# Altium schematic sheet MCU.SchDoc
size A4; SheetNumber: 1; SheetTotal: 4
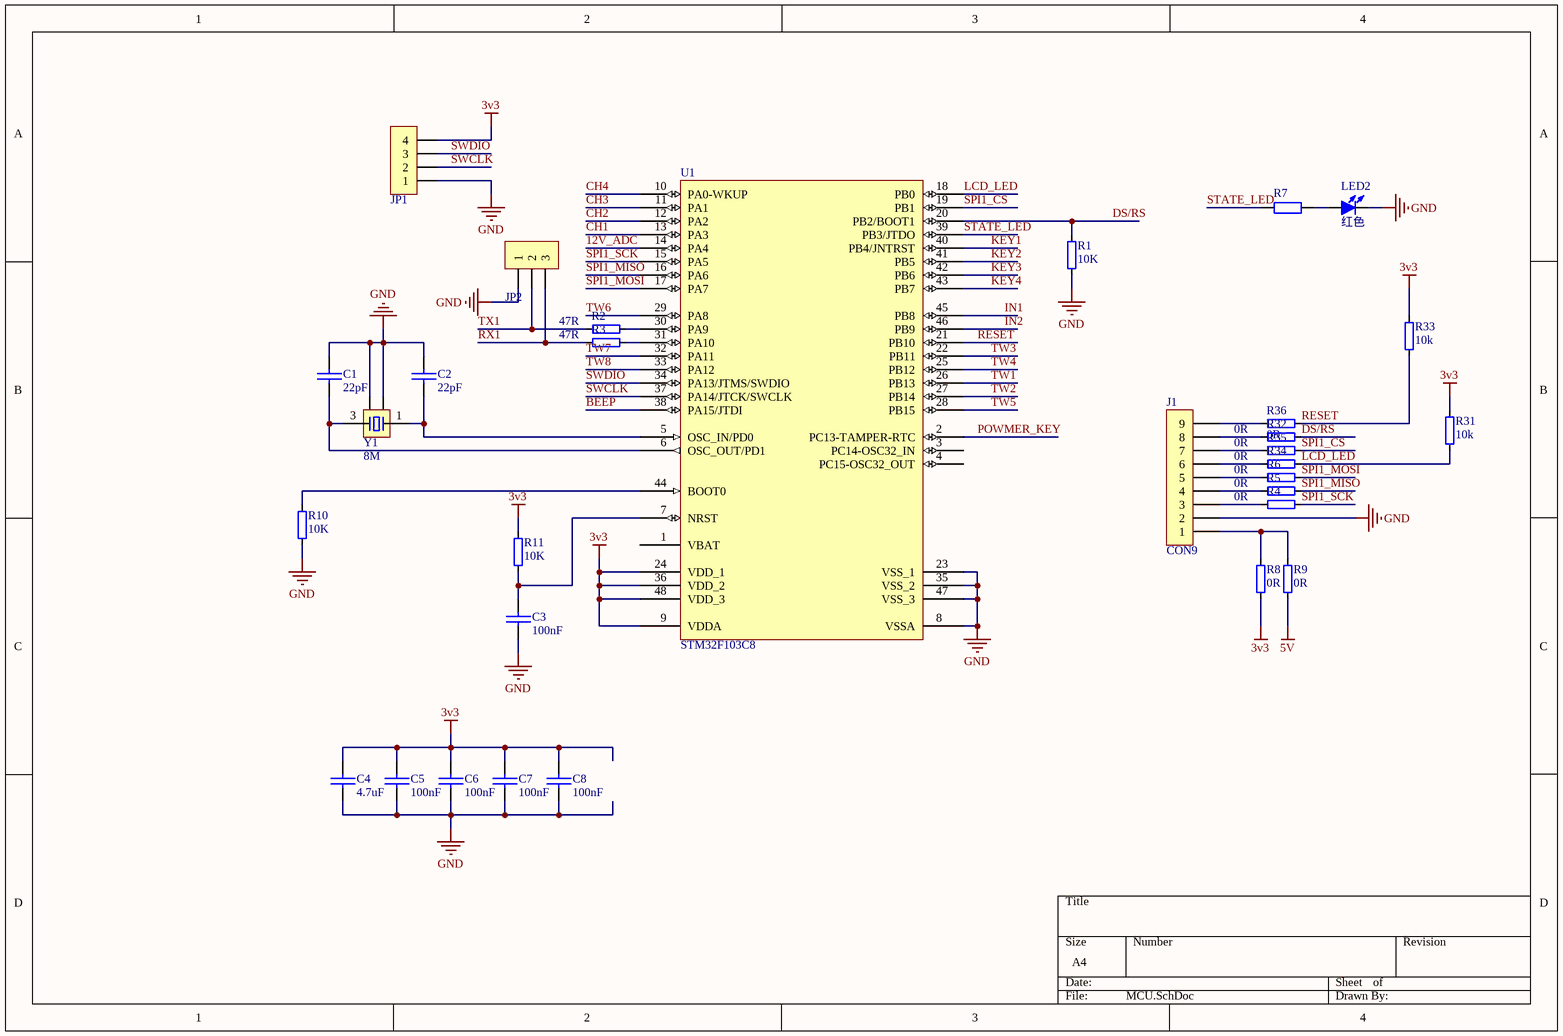
[diagram p0: MCU.SchDoc]

## Parts
C1  22pF  [C 0603_L]
C2  22pF  [C 0603_L]
C3  100nF  [C 0603_L]
C4  4.7uF  [C 0603_L]
C5  100nF  [C 0603_L]
C6  100nF  [C 0603_L]
C7  100nF  [C 0603_L]
C8  100nF  [C 0603_L]
J1  CON9  [HDR2.54-Y-LI-9P]
JP1  HDR-1X4  [HDR2.54-LI-4P]  (value not drawn)
JP2  HDR-1X3  [HDR2.54-LI-3P]  (value not drawn)
LED2  红色  [LED 0805G]
R1  10K  [R 0603_L]
R2  47R  [R 0603_L]
R3  47R  [R 0603_L]
R4  0R  [R 0603_L]
R5  0R  [R 0603_L]
R6  0R  [R 0603_L]
R7  (no value)  [R 0603_L]
R8  0R  [R 0603_L]
R9  0R  [R 0603_L]
R10  10K  [R 0603_L]
R11  10K  [R 0603_L]
R31  10k  [R 0603_L]
R32  0R  [R 0603_L]
R33  10k  [R 0603_L]
R34  0R  [R 0603_L]
R35  0R  [R 0603_L]
R36  0R  [R 0603_L]
U1  STM32F103C8  [LQFP-48_M]
Y1  8M  [OSC 3225-4P]

## Nets
3v3: C4.1 C5.1 C6.1 C7.1 C8.1 JP1.4 R8.2 R11.2 R31.1 R33.1 U1.9(VDDA) U1.24(VDD_1) U1.36(VDD_2) U1.48(VDD_3)
5V: R9.2
GND: C1.1 C2.1 C3.2 C4.2 C5.2 C6.2 C7.2 C8.2 J1.2 JP1.1 JP2.1 LED2.2(K) R1.2 R10.1 U1.8(VSSA) U1.23(VSS_1) U1.35(VSS_2) U1.47(VSS_3) Y1.2 Y1.4
12V_ADC: U1.14(PA4)
BEEP: U1.38(PA15/JTDI)
CH1: U1.13(PA3)
CH2: U1.12(PA2)
CH3: U1.11(PA1)
CH4: U1.10(PA0-WKUP)
DS/RS: R1.1 R32.1 U1.20(PB2/BOOT1)
IN1: U1.45(PB8)
IN2: U1.46(PB9)
KEY1: U1.40(PB4/JNTRST)
KEY2: U1.41(PB5)
KEY3: U1.42(PB6)
KEY4: U1.43(PB7)
LCD_LED: R31.2 R34.1 U1.18(PB0)
POWMER_KEY: U1.2(PC13-TAMPER-RTC)
RESET: R33.2 R36.2 U1.21(PB10)
RX1: JP2.3 R3.2
SPI1_CS: R35.1 U1.19(PB1)
SPI1_MISO: R5.1 U1.16(PA6)
SPI1_MOSI: R6.1 U1.17(PA7)
SPI1_SCK: R4.1 U1.15(PA5)
STATE_LED: R7.1 U1.39(PB3/JTDO)
SWCLK: JP1.2 U1.37(PA14/JTCK/SWCLK)
SWDIO: JP1.3 U1.34(PA13/JTMS/SWDIO)
TW1: U1.26(PB13)
TW2: U1.27(PB14)
TW3: U1.22(PB11)
TW4: U1.25(PB12)
TW5: U1.28(PB15)
TW6: U1.29(PA8)
TW7: U1.32(PA11)
TW8: U1.33(PA12)
TX1: JP2.2 R2.2
NetC1_2: C1.2 U1.6(OSC_OUT/PD1) Y1.3
NetC2_2: C2.2 U1.5(OSC_IN/PD0) Y1.1
NetC3_1: C3.1 R11.1 U1.7(NRST)
NetJ1_1: J1.1 R8.1 R9.1
NetJ1_3: J1.3 R4.2
NetJ1_4: J1.4 R5.2
NetJ1_5: J1.5 R6.2
NetJ1_6: J1.6 R34.2
NetJ1_7: J1.7 R35.2
NetJ1_8: J1.8 R32.2
NetJ1_9: J1.9 R36.1
NetLED2_1: LED2.1(A) R7.2
NetR2_1: R2.1 U1.30(PA9)
NetR3_1: R3.1 U1.31(PA10)
NetR10_2: R10.2 U1.44(BOOT0)

Not connected (* = marked no-connect by the designer): U1 1(VBAT) 3(PC14-OSC32_IN) 4(PC15-OSC32_OUT)

## Library data of the parts
C1-C8 = 普通电容: Capacitor
J1 = CON9: Connector
JP1 = Header 4: 4P接插件; 版权归属: 源创客; BOM名称: 4P接插件; 学习资源: www.ooocke.com
JP2 = Header 3: 3P接插件; 版权归属: 源创客; BOM名称: 3P接插件; 学习资源: www.ooocke.com
LED2 = LED-SMD: 贴片LED; 版权归属: 源创客; BOM名称: 贴片LED; 学习资源: www.ooocke.com
R1-R6 R8-R11 R31-R36 = 普通电阻
R7 = R: 贴片电阻; 版权归属: 源创客; BOM名称: 贴片电阻; 学习资源: www.ooocke.com
U1 = STM32F103C8: Flaah:64/RAM:20/IO:36; BOM名称: 32位STM单片机; 版权归属: 源创客; 学习资源: www.ooocke.com
Y1 = XTAL-4P: 4脚无源晶振; 版权归属: 源创客; BOM名称: 4脚无源晶振; 学习资源: www.ooocke.com